# Altium schematic sheet Random.SchDoc
size A; SheetNumber: 7; SheetTotal: 7
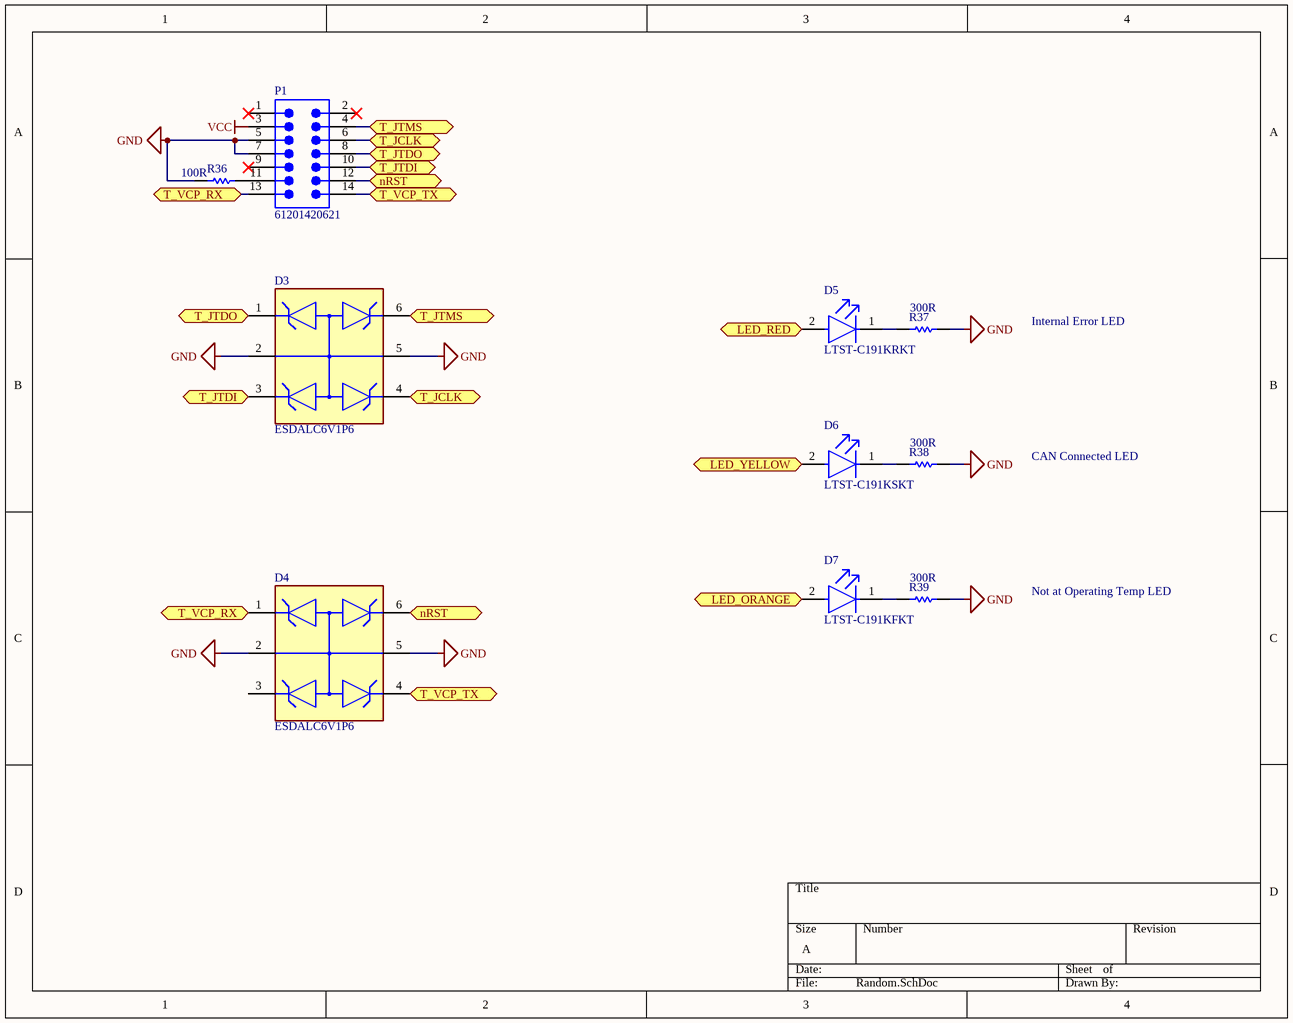
[diagram p0: Random.SchDoc]

## Parts
D3  ESDALC6V1P6  [FP-SOT-666IP-MFG]
D4  ESDALC6V1P6  [FP-SOT-666IP-MFG]
D5  LTST-C191KRKT  [FP-LTST-C191KSKT-MFG]
D6  LTST-C191KSKT  [FP-LTST-C191KSKT-MFG]
D7  LTST-C191KFKT  [FP-LTST-C191KSKT-MFG]
P1  61201420621  [61201420621]
R36  100R  [RESC1608X55X30LL20T20]
R37  300R  [RESC1608X55X30LL20T20]
R38  300R  [RESC1608X55X30LL20T20]
R39  300R  [RESC1608X55X30LL20T20]

## Ports
LED_ORANGE (bidir, see MCUPinout[3C]), LED_RED (bidir, see MCUPinout[1C]), LED_YELLOW (bidir, see MCUPinout[1A], MCUPinout[4C]), nRST (bidir, see ETH[1C], MCUPinout[1B], Random[2A]), nRST (bidir, see ETH[1C], MCUPinout[1B], Random[2C]), T_JCLK (bidir, see MCUPinout[4B], Random[2A]), T_JCLK (bidir, see MCUPinout[4B], Random[2B]), T_JTDI (bidir, see MCUPinout[5C], Random[1B]), T_JTDI (bidir, see MCUPinout[5C], Random[2A]), T_JTDO (bidir, see MCUPinout[4C], Random[1B]), T_JTDO (bidir, see MCUPinout[4C], Random[2A]), T_JTMS (bidir, see MCUPinout[4B], Random[2A]), T_JTMS (bidir, see MCUPinout[4B], Random[2B]), T_VCP_RX (bidir, see MCUPinout[4A], Random[1A]), T_VCP_RX (bidir, see MCUPinout[4A], Random[1C]), T_VCP_TX (bidir, see MCUPinout[4A], Random[2A]), T_VCP_TX (bidir, see MCUPinout[4A], Random[2C])

## Nets
GND: D3.2 D3.5 D4.2 D4.5 P1.5 P1.7 R36.2 R37.2 R38.2 R39.2
VCC: P1.3
LED_ORANGE: D7.2(A) ; port LED_ORANGE
LED_RED: D5.2(A) ; port LED_RED
LED_YELLOW: D6.2(A) ; port LED_YELLOW
nRST: D4.6 P1.12 ; port nRST
T_JCLK: D3.4 P1.6 ; port T_JCLK
T_JTDI: D3.3 P1.10 ; port T_JTDI
T_JTDO: D3.1 P1.8 ; port T_JTDO
T_JTMS: D3.6 P1.4 ; port T_JTMS
T_VCP_RX: D4.1 P1.13 ; port T_VCP_RX
T_VCP_TX: D4.4 P1.14 ; port T_VCP_TX
NetD5_1: D5.1(C) R37.1
NetD6_1: D6.1(C) R38.1
NetD7_1: D7.1(C) R39.1
NetP1_11: P1.11 R36.1

Not connected (* = marked no-connect by the designer): D4 3; P1 1* 2* 9*

## Notes on the sheet
- Internal Error LED
- CAN Connected LED
- Not at Operating Temp LED

## Library data of the parts
D3 D4 = CMP-12225-000016-1: TVS DIODE 3V SOT666IP; Manufacturer: STMicroelectronics; Peak Pulse Power: 30W; Capacitance: 7.5pF; Value: 7.5pF; Number Of Channels: 4; Max Junction Temp: +150°C; Breakdown Voltage: 6.1V; Direction: Unidirectional; Device Class L1: Circuit Protection; Reverse Standoff Voltage: 3V; Package: SOT-666IP; Device Class L3: unset; Temperature Range Low: -40°C; ComponentLink2Description: Datasheet; Height: 0.62mm; ComponentLink2URL: https://www.st.com/resource/en/datasheet/esdalc6v1px.pdf; Category: Diode; RoHS: TRUE; Device Class L2: TVS Diodes; Mouser Description: ESDALC Series 4 Channel 6.1V Uni-Directional Transil? ESD Protection - SOT-666IP; Lead Free: Yes; Manufacturer Part Number: ESDALC6V1P6; Temperature Range High: +150°C; Temperature: -40°C to +150°C; Digikey Description: TVS DIODE 3V SOT666IP; Automotive: No; Octopart: https://octopart.com/esdalc6v1p6-stmicroelectronics-347727
D5-D7 = CMP-22017-000025-1: LED YELLOW CLEAR SMD; Dominant Wavelength: 597nm; Power Rating: 75mW; Number of LEDs: 1; Lens Style: Diffused; Forward Current: 30mA; Test Current: 20mA; Forward Voltage: 2.4V; Wavelength: 588nm; Viewing Angle: 130°; Lens Color: Colorless; Reverse Voltage: 5V; Luminous Intensity: 180mcd; Case Code (Imperial): 0603; Width: 0.8mm; Power Dissipation: 75mW; Length: 1.6mm; Illumination Color: Yellow; Number of Pins: 2; Case Code (Metric): 1608; Mount: Surface Mount; Number of Elements: 1; Height: 0.55mm; Lens Transparency: Clear; Depth: 0.8mm; Min Operating Temperature: -55°C; Case/Package: 0603; Radiation Hardening: No; Max Operating Temperature: 85°C; Package Quantity: 1; Packaging: Tape and Reel; Lead Free: Lead Free; Color: Yellow
P1 = CMP-1502-00053-2: NexarPartId: 24514104; Number of Contacts: 14; Contact Resistance: 20mΩ; Connector Type: Male Pin; Row Spacing: 2.54mm; Gender: Male; Operating Supply Voltage: 250V; RoHS: Compliant; Contact Mating Length: 5.08mm; Contact Plating: Gold; Number of Positions: 14; Color: Black; Orientation: Vertical; Lead Pitch: 2.54mm; Contact Material: Copper; REACH SVHC: Unknown; Number of Pins: 14; Pitch: 2.54mm; Mount: Surface Mount; Number of Rows: 2; Termination: Solder
R36-R39 = CMP-2000-00025-1: Part Number: ERA3AEB301V; Manufacturer: Panasonic